# Altium project bcomed.PrjPcb
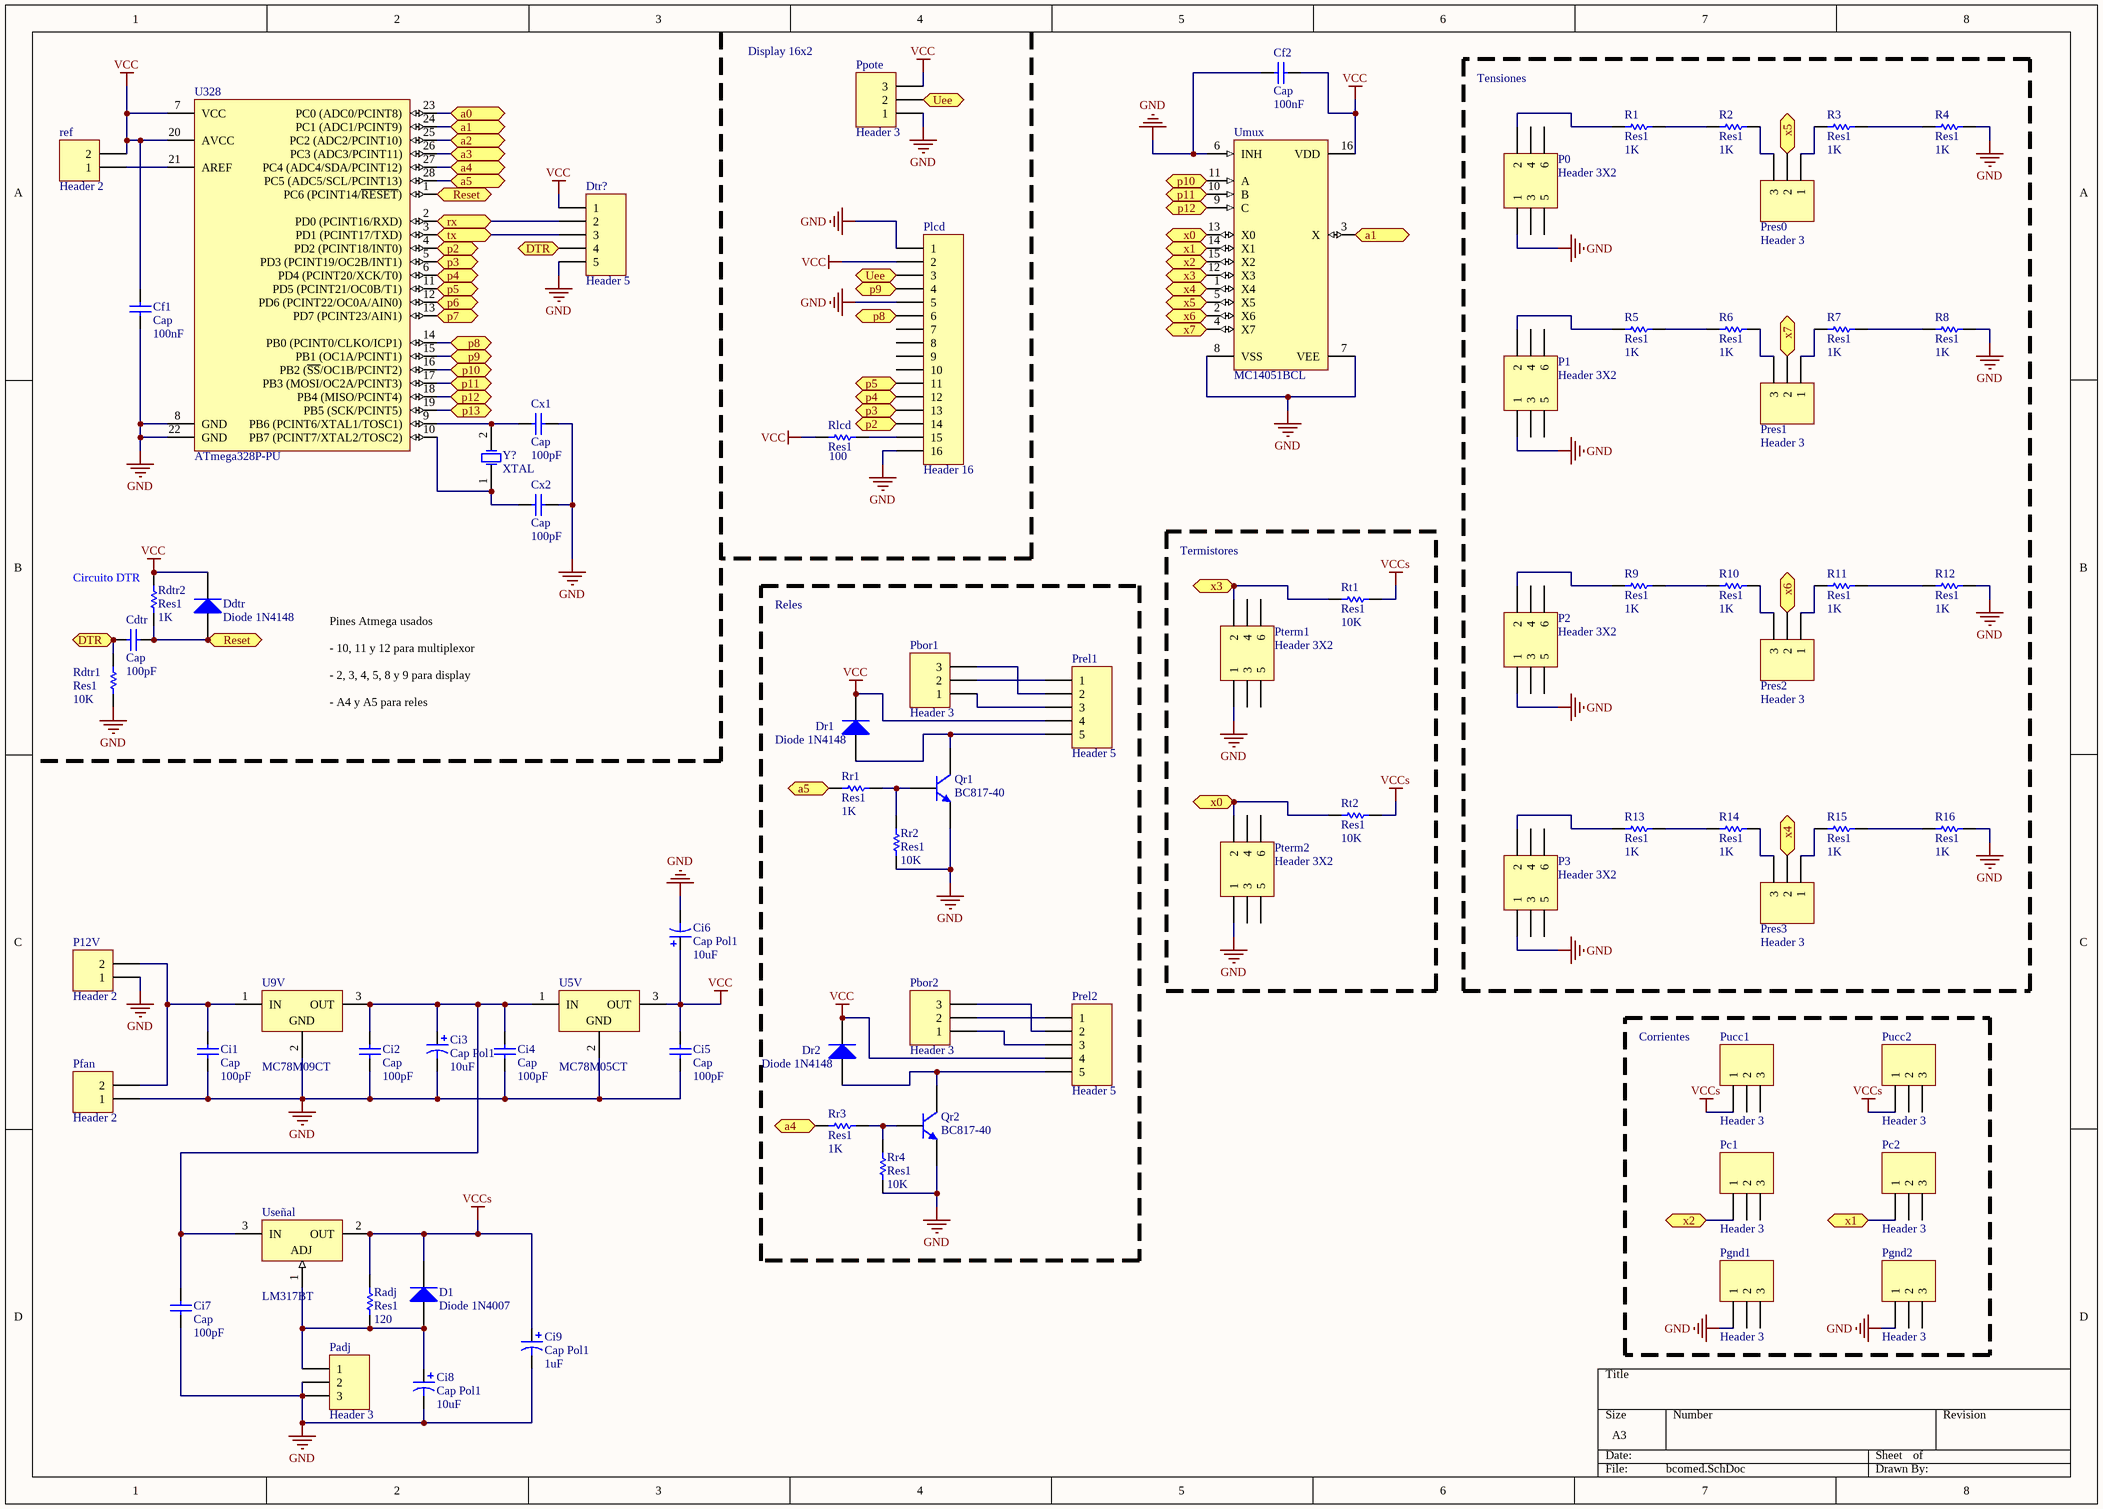
[diagram p0: bcomed.SchDoc]
1 sheet, 79 parts. Net scope: flat (ports and power ports of the same name join across sheets).
Board file: bcomed.PcbDoc

## Sheet bcomed.SchDoc
size A3

### Parts
Cdtr  Cap  value 100pF  [1206ancho]
Cf1  Cap  value 100nF  [1206ancho]
Cf2  Cap  value 100nF  [1206ancho]
Ci1  Cap  value 100pF  [1206ancho]
Ci2  Cap  value 100pF  [1206ancho]
Ci3  Cap Pol1  value 10uF  [CAP-D6P3]
Ci4  Cap  value 100pF  [1206ancho]
Ci5  Cap  value 100pF  [1206ancho]
Ci6  Cap Pol1  value 10uF  [CAP-D6P3]
Ci7  Cap  value 100pF  [1206ancho]
Ci8  Cap Pol1  value 10uF  [CAP-D6P3]
Ci9  Cap Pol1  value 1uF  [CAP-D6P3]
Cx1  Cap  value 100pF  [Cap4]
Cx2  Cap  value 100pF  [Cap4]
D1  Diode 1N4007  [DO-41]
Ddtr  Diode 1N4148  [DO-35]
Dr1  Diode 1N4148  [DO-35]
Dr2  Diode 1N4148  [DO-35]
Dtr?  Header 5  [HDR1X5]
P0  Header 3X2  [conector cable]
P1  Header 3X2  [conector cable]
P2  Header 3X2  [conector cable]
P3  Header 3X2  [conector cable]
P12V  Header 2  [Bornera-2]
Padj  Header 3  [PRESET2]
Pbor1  Header 3  [Bornera-3]
Pbor2  Header 3  [Bornera-3]
Pc1  Header 3  [conector cable simple]
Pc2  Header 3  [conector cable simple]
Pfan  Header 2  [Bornera-2]
Pgnd1  Header 3  [conector cable simple]
Pgnd2  Header 3  [conector cable simple]
Plcd  Header 16  [HDR1X16]
Ppote  Header 3  [HDR1X3]
Prel1  Header 5  [Relay 5V]
Prel2  Header 5  [Relay 5V]
Pres0  Header 3  [PRESET2]
Pres1  Header 3  [PRESET2]
Pres2  Header 3  [PRESET2]
Pres3  Header 3  [PRESET2]
Pterm1  Header 3X2  [conector cable]
Pterm2  Header 3X2  [conector cable]
Pucc1  Header 3  [conector cable simple]
Pucc2  Header 3  [conector cable simple]
Qr1  BC817-40  [SOT-23A_N]
Qr2  BC817-40  [SOT-23A_N]
R1  Res1  value 1K  [AXIAL-0.3]
R2  Res1  value 1K  [AXIAL-0.3]
R3  Res1  value 1K  [AXIAL-0.3]
R4  Res1  value 1K  [AXIAL-0.3]
R5  Res1  value 1K  [AXIAL-0.3]
R6  Res1  value 1K  [AXIAL-0.3]
R7  Res1  value 1K  [AXIAL-0.3]
R8  Res1  value 1K  [AXIAL-0.3]
R9  Res1  value 1K  [AXIAL-0.3]
R10  Res1  value 1K  [AXIAL-0.3]
R11  Res1  value 1K  [AXIAL-0.3]
R12  Res1  value 1K  [AXIAL-0.3]
R13  Res1  value 1K  [AXIAL-0.3]
R14  Res1  value 1K  [AXIAL-0.3]
R15  Res1  value 1K  [AXIAL-0.3]
R16  Res1  value 1K  [AXIAL-0.3]
Radj  Res1  value 120  [AXIAL-0.3]
Rdtr1  Res1  value 10K  [1206ancho]
Rdtr2  Res1  value 1K  [1206ancho]
ref  Header 2  [HDR1X2]
Rlcd  Res1  value 100  [1206ancho]
Rr1  Res1  value 1K  [1206ancho]
Rr2  Res1  value 10K  [1206ancho]
Rr3  Res1  value 1K  [1206ancho]
Rr4  Res1  value 10K  [1206ancho]
Rt1  Res1  value 10K  [1206ancho]
Rt2  Res1  value 10K  [1206ancho]
U5V  MC78M05CT  [221A-09]
U9V  MC78M09CT  [221A-09]
U328  ATmega328P-PU  [28P3]
Umux  MC14051BCL  [620-10]
Useñal  LM317BT  [221A-06]
Y?  XTAL  [Cristal]

### Blocks framed on the sheet
Tensiones: P0-P3 Pres0-Pres3 R1-R16
Termistores: Pterm1 Pterm2 Rt1 Rt2
Reles: Dr1 Dr2 Pbor1 Pbor2 Prel1 Prel2 Qr1 Qr2 Rr1-Rr4
Corrientes: Pc1 Pc2 Pgnd1 Pgnd2 Pucc1 Pucc2

### Ports
a0, a1, a2, a3, a4, a5, DTR, p2, p3, p4, p5, p6, p7, p8, p9, p10, p11, p12, p13, Reset, rx, tx, Uee, x0, x1, x2, x3, x4, x5, x6, x7

### Nets
GND: Cf1.1 Cf2.1 Ci1.1 Ci2.1 Ci3.2 Ci4.1 Ci5.1 Ci6.2 Ci7.2 Ci8.2 Ci9.2 Cx1.2 Cx2.2 Dtr?.5 P0.1 P1.1 P2.1 P3.1 P12V.1 Padj.2 Padj.3 Pfan.1 Pgnd1.1 Pgnd2.1 Plcd.1 Plcd.5 Plcd.16 Ppote.1 Pterm1.1 Pterm2.1 Qr1.2(E) Qr2.2(E) R4.2 R8.2 R12.2 R16.2 Rdtr1.1 Rr2.1 Rr4.1 U5V.2(GND) U9V.2(GND) U328.8(GND) U328.22(GND) Umux.6(INH) Umux.7(VEE) Umux.8(VSS)
VCC: Cf1.2 Cf2.2 Ci5.2 Ci6.1 Ddtr.2(K) Dr1.2(K) Dr2.2(K) Dtr?.1 Plcd.2 Ppote.3 Prel1.4 Prel2.4 Rdtr2.2 ref.2 Rlcd.1 U5V.3(OUT) U328.7(VCC) U328.20(AVCC) Umux.16(VDD)
VCCs: Ci9.1 D1.2(K) Pucc1.1 Pucc2.1 Radj.2 Rt1.2 Rt2.2 Useñal.2(OUT)
NetCdtr_1: Cdtr.1 Dtr?.4 Rdtr1.2 ; port DTR
NetCdtr_2: Cdtr.2 Ddtr.1(A) Rdtr2.1 U328.1(PC6_(PCINT14/~{RESET})) ; port Reset
NetCi1_2: Ci1.2 P12V.2 Pfan.2 U9V.1(IN)
NetCi2_2: Ci2.2 Ci3.1 Ci4.2 Ci7.1 U5V.1(IN) U9V.3(OUT) Useñal.3(IN)
NetCi8_1: Ci8.1 D1.1(A) Padj.1 Radj.1 Useñal.1(ADJ)
NetCx1_1: Cx1.1 U328.9(PB6_(PCINT6/XTAL1/TOSC1)) Y?.2(OSC2)
NetCx2_1: Cx2.1 U328.10(PB7_(PCINT7/XTAL2/TOSC2)) Y?.1(OSC1)
NetDr1_1: Dr1.1(A) Prel1.5 Qr1.3(C)
NetDr2_1: Dr2.1(A) Prel2.5 Qr2.3(C)
NetDtr?_2: Dtr?.2 U328.2(PD0_(PCINT16/RXD)) ; port rx
NetDtr?_3: Dtr?.3 U328.3(PD1_(PCINT17/TXD)) ; port tx
NetP0_2: P0.2 R1.1
NetP1_2: P1.2 R5.1
NetP2_2: P2.2 R9.1
NetP3_2: P3.2 R13.1
NetPbor1_1: Pbor1.1 Prel1.3
NetPbor1_2: Pbor1.2 Prel1.1
NetPbor1_3: Pbor1.3 Prel1.2
NetPbor2_1: Pbor2.1 Prel2.3
NetPbor2_2: Pbor2.2 Prel2.1
NetPbor2_3: Pbor2.3 Prel2.2
NetPc1_1: Pc1.1 Umux.15(X2) ; port x2
NetPc2_1: Pc2.1 Umux.14(X1) ; port x1
NetPlcd_3: Plcd.3 Ppote.2 ; port Uee
NetPlcd_4: Plcd.4 U328.15(PB1_(OC1A/PCINT1)) ; port p9
NetPlcd_6: Plcd.6 U328.14(PB0_(PCINT0/CLKO/ICP1)) ; port p8
NetPlcd_11: Plcd.11 U328.11(PD5_(PCINT21/OC0B/T1)) ; port p5
NetPlcd_12: Plcd.12 U328.6(PD4_(PCINT20/XCK/T0)) ; port p4
NetPlcd_13: Plcd.13 U328.5(PD3_(PCINT19/OC2B/INT1)) ; port p3
NetPlcd_14: Plcd.14 U328.4(PD2_(PCINT18/INT0)) ; port p2
NetPlcd_15: Plcd.15 Rlcd.2
NetPres0_1: Pres0.1 R3.1
NetPres0_2: Pres0.2 Umux.5(X5) ; port x5
NetPres0_3: Pres0.3 R2.2
NetPres1_1: Pres1.1 R7.1
NetPres1_2: Pres1.2 Umux.4(X7) ; port x7
NetPres1_3: Pres1.3 R6.2
NetPres2_1: Pres2.1 R11.1
NetPres2_2: Pres2.2 Umux.2(X6) ; port x6
NetPres2_3: Pres2.3 R10.2
NetPres3_1: Pres3.1 R15.1
NetPres3_2: Pres3.2 Umux.1(X4) ; port x4
NetPres3_3: Pres3.3 R14.2
NetPterm1_2: Pterm1.2 Rt1.1 Umux.12(X3) ; port x3
NetPterm2_2: Pterm2.2 Rt2.1 Umux.13(X0) ; port x0
NetQr1_1: Qr1.1(B) Rr1.2 Rr2.2
NetQr2_1: Qr2.1(B) Rr3.2 Rr4.2
NetR1_2: R1.2 R2.1
NetR3_2: R3.2 R4.1
NetR5_2: R5.2 R6.1
NetR7_2: R7.2 R8.1
NetR9_2: R9.2 R10.1
NetR11_2: R11.2 R12.1
NetR13_2: R13.2 R14.1
NetR15_2: R15.2 R16.1
Netref_1: ref.1 U328.21(AREF)
NetRr1_1: Rr1.1 U328.28(PC5_(ADC5/SCL/PCINT13)) ; port a5
NetRr3_1: Rr3.1 U328.27(PC4_(ADC4/SDA/PCINT12)) ; port a4
NetU328_12: U328.12(PD6_(PCINT22/OC0A/AIN0)) ; port p6
NetU328_13: U328.13(PD7_(PCINT23/AIN1)) ; port p7
NetU328_16: U328.16(PB2_(~{SS}/OC1B/PCINT2)) Umux.11(A) ; port p10
NetU328_17: U328.17(PB3_(MOSI/OC2A/PCINT3)) Umux.10(B) ; port p11
NetU328_18: U328.18(PB4_(MISO/PCINT4)) Umux.9(C) ; port p12
NetU328_19: U328.19(PB5_(SCK/PCINT5)) ; port p13
NetU328_23: U328.23(PC0_(ADC0/PCINT8)) ; port a0
NetU328_24: U328.24(PC1_(ADC1/PCINT9)) Umux.3(X) ; port a1
NetU328_25: U328.25(PC2_(ADC2/PCINT10)) ; port a2
NetU328_26: U328.26(PC3_(ADC3/PCINT11)) ; port a3

Not connected (* = marked no-connect by the designer): P0 3 4 5 6; P1 3 4 5 6; P2 3 4 5 6; P3 3 4 5 6; Pc1 2 3; Pc2 2 3; Pgnd1 2 3; Pgnd2 2 3; Plcd 7 8 9 10; Pterm1 3 4 5 6; Pterm2 3 4 5 6; Pucc1 2 3; Pucc2 2 3

### Notes on the sheet
- Display 16x2
- (near Rdtr2) Circuito DTR
- Pines Atmega usados
  - 10, 11 y 12 para multiplexor
  - 2, 3, 4, 5, 8 y 9 para display
  - A4 y A5 para reles

### Library data of the parts
Cdtr Cf1 Cf2 Ci1 Ci2 Ci4 Ci5 Ci7 Cx1 Cx2 = Cap: Capacitor; Published: 8-Jun-2000; LatestRevisionDate: 17-Jul-2002; LatestRevisionNote: Re-released for DXP Platform.; PackageReference: RAD-0.3; Publisher: Altium Limited; PackageDescription: Radial Cap, Thru-Hole; 2 Leads; 0.3 in Pin Spacing
Ci3 Ci6 Ci8 Ci9 = Cap Pol1: Polarized Capacitor (Radial); Published: 8-Jun-2000; LatestRevisionDate: 17-Jul-2002; LatestRevisionNote: Re-released for DXP Platform.; PackageReference: RB7.6-15; Publisher: Altium Limited; PackageDescription: Polarized Capacitor (Radial); 2 Leads
D1 = Diode 1N4007: 1 Amp General Purpose Rectifier; Published: 8-Jun-2000; LatestRevisionDate: 17-Jul-2002; LatestRevisionNote: Re-released for DXP Platform.; DatasheetVersion: 1998; PackageVersion: Aug-1999; PackageReference: DO-41; Publisher: Altium Limited; PackageDescription: Diode, Axial; Body 5.2 x 2.7 mm (LxDia. max), Lead Dia. 0.86 mm (max); Code_JEDEC: DO-204-AL; ComponentLink1Description: Manufacturer Link; ComponentLink1URL: http://www.fairchildsemi.com/; ComponentLink2Description: Datasheet; ComponentLink2URL: http://www.fairchildsemi.com/ds/1N%2F1N4001.pdf
Ddtr Dr1 Dr2 = Diode 1N4148: High Conductance Fast Diode; Published: 8-Jun-2000; LatestRevisionDate: 17-Jul-2002; LatestRevisionNote: Re-released for DXP Platform.; DatasheetVersion: 1997; PackageReference: DO-35; Publisher: Altium Limited; PackageDescription: Diode, Axial; Body 3.8 x 1.9 mm (LxDia. max), Lead Dia. 0.53 mm (max); Code_JEDEC: DO-204-AH; ComponentLink1Description: Manufacturer Link; ComponentLink1URL: http://www.fairchildsemi.com/; ComponentLink2Description: Datasheet; ComponentLink2URL: http://www.fairchildsemi.com/ds/1N%2F1N4148.pdf
Dtr? Prel1 Prel2 = Header 5: Header, 5-Pin; LatestRevisionDate: 17-Jul-2002; LatestRevisionNote: Re-released for DXP Platform.; Publisher: Altium Limited
P0-P3 Pterm1 Pterm2 = Header 3X2: Header, 3-Pin, Dual row; LatestRevisionDate: 17-Jul-2002; LatestRevisionNote: Re-released for DXP Platform.; Publisher: Altium Limited
P12V Pfan ref = Header 2: Header, 2-Pin; LatestRevisionDate: 17-Jul-2002; LatestRevisionNote: Re-released for DXP Platform.; Publisher: Altium Limited
Padj Pbor1 Pbor2 Pc1 Pc2 Pgnd1 Pgnd2 Ppote Pres0-Pres3 Pucc1 Pucc2 = Header 3: Header, 3-Pin; LatestRevisionDate: 17-Jul-2002; LatestRevisionNote: Re-released for DXP Platform.; Publisher: Altium Limited
Plcd = Header 16: Header, 16-Pin; LatestRevisionDate: 17-Jul-2002; LatestRevisionNote: Re-released for DXP Platform.; Publisher: Altium Limited
Qr1 Qr2 = BC817-40: NPN General Purpose Amplifier; Published: 8-Jun-2000; LatestRevisionDate: 20-Nov-2009; LatestRevisionNote: IPC-7351 Footprint Added.; DatasheetVersion: 1997; PackageVersion: Sep-1998; PackageReference: SOT-23A; Publisher: Altium Limited; PackageDescription: 3-Pin SOT-23 Package 0.95 mm Pitch, 2.3 mm Lead Span; ComponentLink1Description: Manufacturer Link; ComponentLink1URL: http://www.fairchildsemi.com/; ComponentLink2Description: Discontinuation Notice; ComponentLink2URL: http://www.fairchildsemi.com/obsolete/obs.jsp
R1-R16 Radj Rdtr1 Rdtr2 Rlcd Rr1-Rr4 Rt1 Rt2 = Res1: Resistor; Published: 8-Jun-2000; LatestRevisionDate: 17-Jul-2002; LatestRevisionNote: Re-released for DXP Platform.; PackageReference: AXIAL-0.3; Publisher: Altium Limited; PackageDescription: Axial Device, Thru-Hole; 2 Leads; 0.3 in Pin Spacing
U5V = MC78M05CT: Three-Terminal Medium Current Positive Voltage Regulator; Note: Heatsink surface connected to Pin 2; Published: 15-Apr-2002; DatasheetVersion: Apr-2000; PackageReference: 221A-09; Publisher: Altium Limited; PackageDescription: TO, Thru-Hole, Vertical, Heatsink Mounted; 3 In-Line Leads; Pitch 2.54 mm; Code_JEDEC: TO-262-AA; ComponentLink1Description: Manufacturer Link; ComponentLink1URL: http://www.onsemi.com/site/products/taxonomy/0,4438,503,00.html; ComponentLink2Description: Datasheet; ComponentLink2URL: http://www.onsemi.com/pub/Collateral/MC78M00-D.PDF
U9V = MC78M09CT: Three-Terminal Medium Current Positive Voltage Regulator; Note: Heatsink surface connected to Pin 2; Published: 15-Apr-2002; DatasheetVersion: Apr-2000; PackageReference: 221A-09; Publisher: Altium Limited; PackageDescription: TO, Thru-Hole, Vertical, Heatsink Mounted; 3 In-Line Leads; Pitch 2.54 mm; Code_JEDEC: TO-262-AA; ComponentLink1Description: Manufacturer Link; ComponentLink1URL: http://www.onsemi.com/site/products/taxonomy/0,4438,503,00.html; ComponentLink2Description: Datasheet; ComponentLink2URL: http://www.onsemi.com/pub/Collateral/MC78M00-D.PDF
U328 = ATmega328P-PU: 8-bit AVR Microcontroller, 32KB Flash, 1KB EEPROM, 2KB SRAM, 28-pin PDIP, Industrial Grade (-40°C to 85°C); Published: 1-Apr-2010; DatasheetVersion: revA, Jan-2010; PackageVersion: revB, Sep-2001; PackageReference: 28P3; Publisher: Altium Limited; PackageDescription: 28-lead (0.300"/7.62mm Wide) Plastic Dual Inline Package (PDIP); Supplier 1: Digi-Key; Supplier Part Number 1: ATMEGA328P-PU-ND; Supplier 2: Farnell; Supplier Part Number 2: 1715487; Supplier 3: Mouser; Supplier Part Number 3: 556-ATMEGA328P-PU; ComponentLink1Description: Manufacturer Link; ComponentLink1URL: http://www.atmel.com/products/avr/default.asp?; ComponentLink2Description: ATmega48A/48PA/88A/88PA/168A/168PA/328/328P Datasheet; ComponentLink2URL: http://www.atmel.com/dyn/resources/prod_documents/8271.pdf; ComponentLink3Description: ATmega48A/48PA/88A/88PA/168A/168PA/328/328P Summary; ComponentLink3URL: http://www.atmel.com/dyn/resources/prod_documents/8271S.pdf; ComponentLink4Description: Atmel.com Home; ComponentLink4URL: http://www.atmel.com
Umux = MC14051BCL: 8-Channel Analog Multiplexer/Demultiplexer; Published: 15-Apr-2002; DatasheetVersion: 1995; PackageVersion: 1996; PackageReference: 620-10; Publisher: Altium Limited; PackageDescription: DIP; 16 Leads; Row Spacing 7.62 mm; Pitch 2.54 mm; ComponentLink1Description: Manufacturer Link; ComponentLink1URL: http://www.onsemi.com/; ComponentLink2Description: Datasheet; ComponentLink2URL: http://www.onsemi.com/pub/Collateral/MC14051B-D.PDF
Useñal = LM317BT: Three-Terminal Adjustable Output Positive Voltage Regulator; Note: Heatsink surface connected to Pin 2; Published: 15-Apr-2002; DatasheetVersion: 1996; PackageVersion: 1997; PackageReference: 221A-06; Publisher: Altium Limited; PackageDescription: TO, Thru-Hole, Vertical, Heatsink Mounted; 3 In-Line Leads; Pitch 2.54 mm; Code_JEDEC: TO-262-AA; ComponentLink1Description: Manufacturer Link; ComponentLink1URL: http://www.onsemi.com/site/products/taxonomy/0,4438,503,00.html; ComponentLink2Description: Datasheet; ComponentLink2URL: http://www.onsemi.com/pub/Collateral/LM317-D.PDF
Y? = XTAL: Crystal Oscillator; Published: 8-Jun-2000; LatestRevisionDate: 17-Jul-2002; LatestRevisionNote: Re-released for DXP Platform.; PackageReference: R38; Publisher: Altium Limited; PackageDescription: Crystal, Thru-Hole; 2 Leads; Body 3.1 x 8.2 mm (Dia.xH)